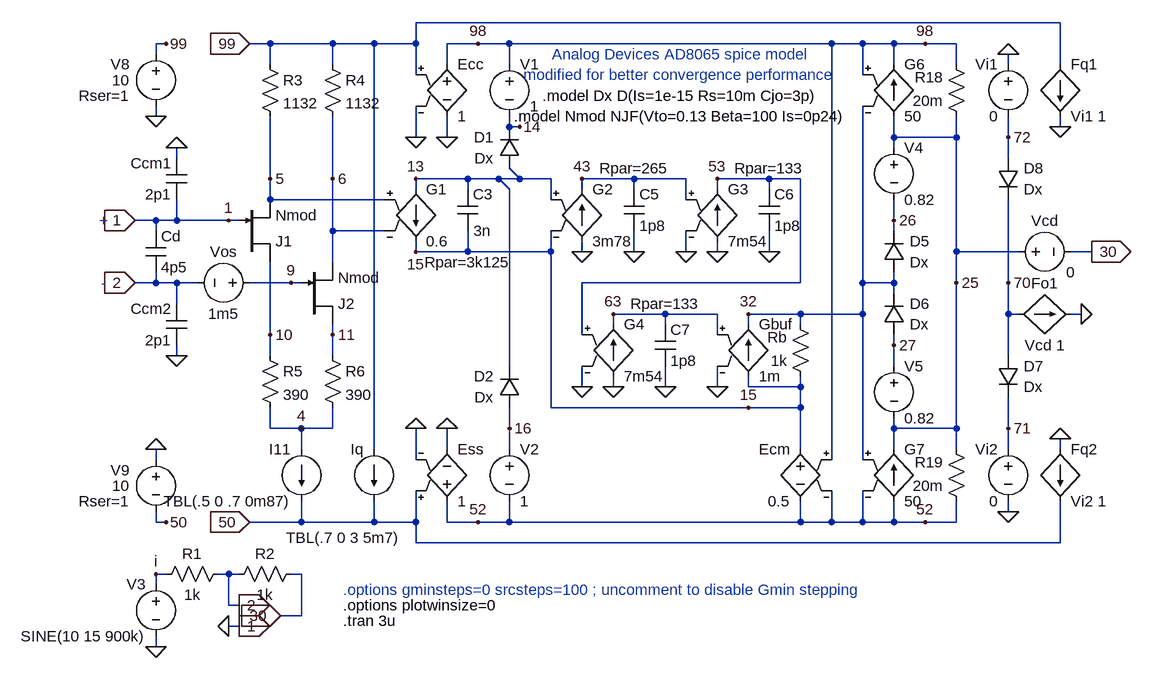
[diagram p0: schematic AD8065new.asc]
AD8065new.asc, the LTspice schematic file:
Version 4
SHEET 1 1544 972
WIRE 1344 -192 352 -192
WIRE -32 -160 -48 -160
WIRE 128 -160 96 -160
WIRE 224 -160 128 -160
WIRE 288 -160 224 -160
WIRE 352 -160 352 -192
WIRE 352 -160 288 -160
WIRE 448 -160 400 -160
WIRE 496 -160 448 -160
WIRE 992 -160 496 -160
WIRE 1040 -160 992 -160
WIRE 1088 -160 1040 -160
WIRE 1136 -160 1088 -160
WIRE 1184 -160 1136 -160
WIRE -48 -144 -48 -160
WIRE 128 -128 128 -160
WIRE 224 -128 224 -160
WIRE 400 -128 400 -160
WIRE 496 -128 496 -160
WIRE 1088 -128 1088 -160
WIRE 1184 -128 1184 -160
WIRE 1264 -128 1264 -144
WIRE 1344 -128 1344 -192
WIRE 352 -112 352 -160
WIRE 1040 -112 1040 -160
WIRE -48 -48 -48 -64
WIRE 496 -32 496 -48
WIRE 512 -32 496 -32
WIRE 1344 -32 1344 -48
WIRE 352 -16 352 -64
WIRE 400 -16 400 -48
WIRE 1088 -16 1088 -48
WIRE 1184 -16 1184 -48
WIRE 1184 -16 1088 -16
WIRE 1264 -16 1264 -48
WIRE 1088 0 1088 -16
WIRE -16 16 -16 0
WIRE 1264 16 1264 -16
WIRE 128 48 128 -48
WIRE 224 48 224 -48
WIRE 432 48 352 48
WIRE 480 48 432 48
WIRE 512 48 496 32
WIRE 512 48 480 48
WIRE 560 48 512 48
WIRE 688 48 608 48
WIRE 768 48 688 48
WIRE 896 48 816 48
WIRE 944 48 896 48
WIRE 352 64 352 48
WIRE 432 64 432 48
WIRE 496 64 480 48
WIRE 608 64 608 48
WIRE 688 64 688 48
WIRE 816 64 816 48
WIRE 896 64 896 48
WIRE 128 80 128 48
WIRE 304 80 128 80
WIRE 560 80 560 48
WIRE 768 80 768 48
WIRE -48 112 -80 112
WIRE -16 112 -16 80
WIRE -16 112 -48 112
WIRE 64 112 -16 112
WIRE 80 112 64 112
WIRE 1088 112 1088 80
WIRE -48 128 -48 112
WIRE 224 128 224 48
WIRE 304 128 224 128
WIRE 1088 128 1088 112
WIRE 352 160 352 144
WIRE 432 160 432 128
WIRE 432 160 352 160
WIRE 560 160 560 128
WIRE 560 160 432 160
WIRE 608 160 608 144
WIRE 688 160 688 128
WIRE 768 160 768 128
WIRE 816 160 816 144
WIRE 896 160 896 128
WIRE 1184 160 1184 -16
WIRE 1280 160 1184 160
WIRE 1392 160 1360 160
WIRE 224 176 224 128
WIRE -48 208 -48 192
WIRE -48 208 -80 208
WIRE -16 208 -48 208
WIRE 16 208 -16 208
WIRE 160 208 96 208
WIRE 176 208 160 208
WIRE 944 208 944 48
WIRE 944 208 608 208
WIRE 1040 208 1040 -64
WIRE 1088 208 1088 192
WIRE 1088 208 1040 208
WIRE 1184 208 1184 160
WIRE 1264 208 1264 80
WIRE 1088 224 1088 208
WIRE -16 240 -16 208
WIRE 736 256 656 256
WIRE 816 256 736 256
WIRE 944 256 864 256
WIRE 1040 256 1040 208
WIRE 1040 256 944 256
WIRE 1264 256 1264 208
WIRE 1280 256 1264 256
WIRE 1376 256 1360 256
WIRE 656 272 656 256
WIRE 736 272 736 256
WIRE 864 272 864 256
WIRE 944 272 944 256
WIRE 128 288 128 176
WIRE 224 288 224 272
WIRE 608 288 608 208
WIRE 816 288 816 256
WIRE 1088 304 1088 288
WIRE -16 320 -16 304
WIRE 128 320 128 288
WIRE 224 320 224 288
WIRE 1264 320 1264 256
WIRE 496 336 496 64
WIRE 1088 336 1088 304
WIRE 608 368 608 336
WIRE 656 368 656 352
WIRE 736 368 736 336
WIRE 816 368 816 336
WIRE 864 368 864 352
WIRE 944 368 944 352
WIRE 944 368 864 368
WIRE 560 400 560 160
WIRE 864 400 560 400
WIRE 944 400 944 368
WIRE 944 400 864 400
WIRE 128 432 128 400
WIRE 176 432 128 432
WIRE 224 432 224 400
WIRE 224 432 176 432
WIRE 496 432 496 400
WIRE 1088 432 1088 416
WIRE 1184 432 1184 208
WIRE 1184 432 1088 432
WIRE 1264 432 1264 384
WIRE 176 464 176 432
WIRE 288 464 288 -160
WIRE 400 464 400 432
WIRE 496 464 496 432
WIRE 944 464 944 400
WIRE 1088 464 1088 432
WIRE 1184 464 1184 432
WIRE 1264 464 1264 432
WIRE 1344 464 1344 448
WIRE -48 480 -48 464
WIRE 352 480 352 432
WIRE 992 480 992 -160
WIRE 1040 480 1040 256
WIRE 1264 560 1264 544
WIRE -48 576 -48 560
WIRE -32 576 -48 576
WIRE 176 576 176 544
WIRE 176 576 96 576
WIRE 288 576 288 544
WIRE 288 576 176 576
WIRE 352 576 352 528
WIRE 352 576 288 576
WIRE 400 576 400 544
WIRE 448 576 400 576
WIRE 496 576 496 544
WIRE 496 576 448 576
WIRE 944 576 944 544
WIRE 944 576 496 576
WIRE 992 576 992 528
WIRE 992 576 944 576
WIRE 1040 576 1040 528
WIRE 1040 576 992 576
WIRE 1088 576 1088 544
WIRE 1088 576 1040 576
WIRE 1136 576 1088 576
WIRE 1184 576 1184 544
WIRE 1184 576 1136 576
WIRE 352 608 352 576
WIRE 1344 608 1344 544
WIRE 1344 608 352 608
WIRE -32 656 -48 656
WIRE 64 656 48 656
WIRE 80 656 64 656
WIRE 176 656 160 656
WIRE -48 672 -48 656
WIRE 64 704 64 656
WIRE 80 704 64 704
WIRE 176 720 176 656
WIRE 176 720 144 720
WIRE 80 736 64 736
WIRE -48 768 -48 752
FLAG -80 112 1
IOPIN -80 112 In
FLAG -80 208 2
IOPIN -80 208 In
FLAG 160 208 9
FLAG -16 320 0
FLAG -16 0 0
FLAG 96 -160 99
IOPIN 96 -160 In
FLAG 128 48 5
FLAG 96 576 50
IOPIN 96 576 In
FLAG 176 432 4
FLAG 224 48 6
FLAG 224 288 11
FLAG 128 288 10
FLAG 64 112 1
FLAG 352 -16 0
FLAG 400 -16 0
FLAG 448 -160 98
FLAG 352 432 0
FLAG 400 432 0
FLAG 448 576 52
FLAG 352 160 15
FLAG 352 48 13
FLAG 512 -32 14
FLAG 496 432 16
FLAG 608 48 43
FLAG 816 48 53
FLAG 656 256 63
FLAG 864 256 32
FLAG 1184 208 25
FLAG 1392 160 30
IOPIN 1392 160 Out
FLAG 1088 304 27
FLAG 1088 112 26
FLAG 1264 208 70
FLAG 1264 432 71
FLAG 1264 -16 72
FLAG 1376 256 0
FLAG 1264 -144 0
FLAG 1264 560 0
FLAG 608 160 0
FLAG 688 160 0
FLAG 768 160 0
FLAG 816 160 0
FLAG 896 160 0
FLAG 608 368 0
FLAG 656 368 0
FLAG 736 368 0
FLAG 816 368 0
FLAG 64 736 0
FLAG -48 656 i
FLAG -48 768 0
FLAG -32 -160 99
FLAG -48 -48 0
FLAG -32 576 50
FLAG -48 464 0
FLAG 80 704 2
IOPIN 80 704 Out
FLAG 80 736 1
IOPIN 80 736 Out
FLAG 144 720 30
IOPIN 144 720 In
FLAG 1344 448 0
FLAG 1344 -32 0
FLAG 864 400 15
FLAG 1136 -160 98
FLAG 1136 576 52
SYMBOL njf 80 176 M180
SYMATTR InstName J1
SYMATTR Value Nmod
SYMBOL njf 176 272 M180
SYMATTR InstName J2
SYMATTR Value Nmod
SYMBOL cap -64 128 R0
WINDOW 3 24 56 Left 0
SYMATTR Value 4p5
SYMATTR InstName Cd
SYMBOL voltage 112 208 R90
WINDOW 0 -32 56 VBottom 0
WINDOW 3 32 56 VTop 0
SYMATTR InstName Vos
SYMATTR Value 1m5
SYMBOL cap 0 16 M0
WINDOW 3 24 56 Left 0
SYMATTR Value 2p1
SYMATTR InstName Ccm1
SYMBOL cap 0 240 M0
WINDOW 3 24 56 Left 0
SYMATTR Value 2p1
SYMATTR InstName Ccm2
SYMBOL res 112 -144 R0
SYMATTR InstName R3
SYMATTR Value 1132
SYMBOL res 208 -144 R0
SYMATTR InstName R4
SYMATTR Value 1132
SYMBOL current 176 464 M0
WINDOW 123 0 0 Left 0
WINDOW 39 0 0 Left 0
WINDOW 0 16 0 Left 0
WINDOW 3 16 80 Left 0
SYMATTR InstName I11
SYMATTR Value TBL(.5 0 .7 0m87)
SYMBOL res 112 304 R0
SYMATTR InstName R5
SYMATTR Value 390
SYMBOL res 208 304 R0
SYMATTR InstName R6
SYMATTR Value 390
SYMBOL e 400 -144 R0
WINDOW 0 16 16 Left 0
WINDOW 3 16 96 Left 0
SYMATTR InstName Ecc
SYMATTR Value 1
SYMBOL e 400 560 M180
WINDOW 0 16 96 Left 0
WINDOW 3 16 16 Left 0
SYMATTR InstName Ess
SYMATTR Value 1
SYMBOL g2 352 160 M180
WINDOW 0 16 96 Left 0
WINDOW 3 16 16 Left 0
SYMATTR InstName G1
SYMATTR Value 0.6
SYMBOL cap 416 64 R0
WINDOW 3 25 64 Left 0
WINDOW 39 16 112 Center 0
SYMATTR Value 3n
SYMATTR SpiceLine Rpar=3k125
SYMATTR InstName C3
SYMBOL voltage 496 -144 R0
WINDOW 0 16 16 Left 0
WINDOW 3 32 80 Left 0
WINDOW 123 0 0 Left 0
WINDOW 39 16 36 Left 0
SYMATTR InstName V1
SYMATTR Value 1
SYMBOL voltage 496 448 R0
WINDOW 0 16 16 Left 0
WINDOW 3 16 96 Left 0
WINDOW 123 0 0 Left 0
WINDOW 39 16 116 Left 0
SYMATTR InstName V2
SYMATTR Value 1
SYMBOL diode 512 32 R180
WINDOW 0 40 48 Left 0
WINDOW 3 40 16 Left 0
SYMATTR InstName D1
SYMATTR Value Dx
SYMBOL diode 512 400 R180
WINDOW 0 40 48 Left 0
WINDOW 3 40 16 Left 0
SYMATTR InstName D2
SYMATTR Value Dx
SYMBOL g 608 48 R0
WINDOW 0 16 16 Left 0
WINDOW 3 16 96 Left 0
SYMATTR InstName G2
SYMATTR Value 3m78
SYMBOL cap 672 64 R0
WINDOW 39 16 -32 Center 0
SYMATTR SpiceLine Rpar=265
SYMATTR InstName C5
SYMATTR Value 1p8
SYMBOL g 816 48 R0
WINDOW 0 16 16 Left 0
WINDOW 3 16 96 Left 0
SYMATTR InstName G3
SYMATTR Value 7m54
SYMBOL cap 880 64 R0
WINDOW 39 16 -32 Center 0
SYMATTR SpiceLine Rpar=133
SYMATTR InstName C6
SYMATTR Value 1p8
SYMBOL g 656 256 R0
WINDOW 0 16 16 Left 0
WINDOW 3 16 96 Left 0
SYMATTR InstName G4
SYMATTR Value 7m54
SYMBOL cap 720 272 R0
WINDOW 39 16 -32 Center 0
SYMATTR SpiceLine Rpar=133
SYMATTR InstName C7
SYMATTR Value 1p8
SYMBOL g 864 256 R0
WINDOW 0 16 16 Left 0
WINDOW 3 16 96 Left 0
SYMATTR InstName Gbuf
SYMATTR Value 1m
SYMBOL res 960 368 R180
WINDOW 0 36 76 Left 0
WINDOW 3 36 40 Left 0
SYMATTR InstName Rb
SYMATTR Value 1k
SYMBOL res 1200 -32 R180
WINDOW 0 36 76 Left 0
WINDOW 3 36 40 Left 0
SYMATTR InstName R18
SYMATTR Value 20m
SYMBOL res 1200 560 R180
WINDOW 0 36 76 Left 0
WINDOW 3 36 40 Left 0
SYMATTR InstName R19
SYMATTR Value 20m
SYMBOL voltage 1264 160 M90
WINDOW 0 -32 56 VBottom 0
WINDOW 3 16 96 VTop 0
SYMATTR InstName Vcd
SYMATTR Value 0
SYMBOL g 1088 -144 R0
WINDOW 0 16 16 Left 0
WINDOW 3 16 96 Left 0
SYMATTR InstName G6
SYMATTR Value 50
SYMBOL g 1088 448 R0
WINDOW 0 16 16 Left 0
WINDOW 3 16 96 Left 0
SYMATTR InstName G7
SYMATTR Value 50
SYMBOL diode 1072 192 M180
WINDOW 0 40 48 Left 0
WINDOW 3 40 16 Left 0
SYMATTR InstName D5
SYMATTR Value Dx
SYMBOL diode 1072 288 M180
WINDOW 0 40 48 Left 0
WINDOW 3 40 16 Left 0
SYMATTR InstName D6
SYMATTR Value Dx
SYMBOL voltage 1088 -16 R0
WINDOW 0 16 16 Left 0
WINDOW 3 16 96 Left 0
SYMATTR InstName V4
SYMATTR Value 0.82
SYMBOL voltage 1088 320 R0
WINDOW 3 16 96 Left 0
WINDOW 0 16 16 Left 0
SYMATTR Value 0.82
SYMATTR InstName V5
SYMBOL f 1280 256 R270
WINDOW 0 32 40 VTop 0
WINDOW 3 -32 40 VBottom 0
SYMATTR InstName Fo1
SYMATTR Value Vcd 1
SYMBOL diode 1248 320 R0
WINDOW 0 40 16 Left 0
WINDOW 3 40 48 Left 0
SYMATTR InstName D7
SYMATTR Value Dx
SYMBOL diode 1248 16 R0
WINDOW 0 40 16 Left 0
WINDOW 3 40 48 Left 0
SYMATTR InstName D8
SYMATTR Value Dx
SYMBOL voltage 1264 -144 M0
WINDOW 0 16 16 Left 0
WINDOW 3 16 96 Left 0
SYMATTR InstName Vi1
SYMATTR Value 0
SYMBOL voltage 1264 448 M0
WINDOW 0 16 16 Left 0
WINDOW 3 16 96 Left 0
SYMATTR InstName Vi2
SYMATTR Value 0
SYMBOL current 288 464 M0
WINDOW 123 0 0 Left 0
WINDOW 39 0 0 Left 0
WINDOW 0 16 0 Left 0
WINDOW 3 -40 136 Left 0
SYMATTR InstName Iq
SYMATTR Value TBL(.7 0 3 5m7)
SYMBOL res 64 640 R90
WINDOW 0 0 56 VBottom 0
WINDOW 3 32 56 VTop 0
SYMATTR InstName R1
SYMATTR Value 1k
SYMBOL res 176 640 R90
WINDOW 0 0 56 VBottom 0
WINDOW 3 32 56 VTop 0
SYMATTR InstName R2
SYMATTR Value 1k
SYMBOL voltage -48 656 M0
WINDOW 123 0 0 Left 0
WINDOW 39 0 0 Left 0
WINDOW 0 16 16 Left 0
WINDOW 3 16 96 Left 0
SYMATTR InstName V3
SYMATTR Value SINE(10 15 900k)
SYMBOL voltage -48 -160 M0
WINDOW 123 0 0 Left 0
WINDOW 39 40 80 Left 0
WINDOW 3 40 56 Left 0
WINDOW 0 40 32 Left 0
SYMATTR SpiceLine Rser=1
SYMATTR Value 10
SYMATTR InstName V8
SYMBOL voltage -48 464 M0
WINDOW 123 0 0 Left 0
WINDOW 39 40 80 Left 0
WINDOW 0 40 32 Left 0
WINDOW 3 40 56 Left 0
SYMATTR SpiceLine Rser=1
SYMATTR InstName V9
SYMATTR Value 10
SYMBOL f 1344 -128 R0
WINDOW 0 16 0 Left 0
WINDOW 3 16 80 Left 0
SYMATTR InstName Fq1
SYMATTR Value Vi1 1
SYMBOL f 1344 464 R0
WINDOW 0 16 0 Left 0
WINDOW 3 16 80 Left 0
SYMATTR InstName Fq2
SYMATTR Value Vi2 1
SYMBOL e 944 448 M0
WINDOW 0 16 16 Left 0
WINDOW 3 16 96 Left 0
SYMATTR InstName Ecm
SYMATTR Value 0.5
TEXT -128 112 Center 0 ;+
TEXT -128 208 Center 0 ;-
TEXT 760 -64 Center 0 !.model Dx D(Is=1e-15 Rs=10m Cjo=3p)\n.model Nmod NJF(Vto=0.13 Beta=100 Is=0p24)
TEXT 240 728 Left 0 !.tran 3u
TEXT 240 704 Left 0 !.options plotwinsize=0
TEXT 760 -128 Center 0 ;Analog Devices AD8065 spice model\nmodified for better convergence performance
TEXT 240 680 Left 0 ;.options gminsteps=0 srcsteps=100 ; uncomment to disable Gmin stepping

The netlist it stands for:
* AD8065new.asc
J1 10 0 5 Nmod
J2 11 9 6 Nmod
Cd 0 2 4p5
Vos 9 2 1m5
Ccm1 0 0 2p1
Ccm2 2 0 2p1
R3 99 5 1132
R4 99 6 1132
I11 4 50 TBL(.5 0 .7 0m87)
R5 10 4 390
R6 11 4 390
Ecc 98 0 99 0 1
Ess 52 0 50 0 1
G1 13 15 5 6 0.6
C3 13 15 3n Rpar=3k125
V1 98 14 1
V2 16 52 1
D1 13 14 Dx
D2 16 13 Dx
G2 0 43 13 15 3m78
C5 43 0 1p8 Rpar=265
G3 0 53 43 0 7m54
C6 53 0 1p8 Rpar=133
G4 0 63 53 0 7m54
C7 63 0 1p8 Rpar=133
Gbuf 15 32 63 0 1m
Rb 15 32 1k
R18 25 98 20m
R19 52 25 20m
Vcd 25 30 0
G6 25 98 98 32 50
G7 52 25 32 52 50
D5 32 26 Dx
D6 27 32 Dx
V4 25 26 0.82
V5 27 25 0.82
Fo1 70 0 Vcd 1
D7 70 71 Dx
D8 72 70 Dx
Vi1 0 72 0
Vi2 71 0 0
Iq 99 50 TBL(.7 0 3 5m7)
R1 2 i 1k
R2 30 2 1k
V3 i 0 SINE(10 15 900k)
V8 99 0 10 Rser=1
V9 0 50 10 Rser=1
Fq1 99 0 Vi1 1
Fq2 0 50 Vi2 1
Ecm 15 52 98 52 0.5
.model D D
.lib standard.dio
.model NJF NJF
.model PJF PJF
.lib standard.jft
* +
* -
.model Dx D(Is=1e-15 Rs=10m Cjo=3p)
.model Nmod NJF(Vto=0.13 Beta=100 Is=0p24)
.tran 3u
.options plotwinsize=0
* Analog Devices AD8065 spice model
* modified for better convergence performance
* .options gminsteps=0 srcsteps=100 ; uncomment to disable Gmin stepping
.backanno
.end